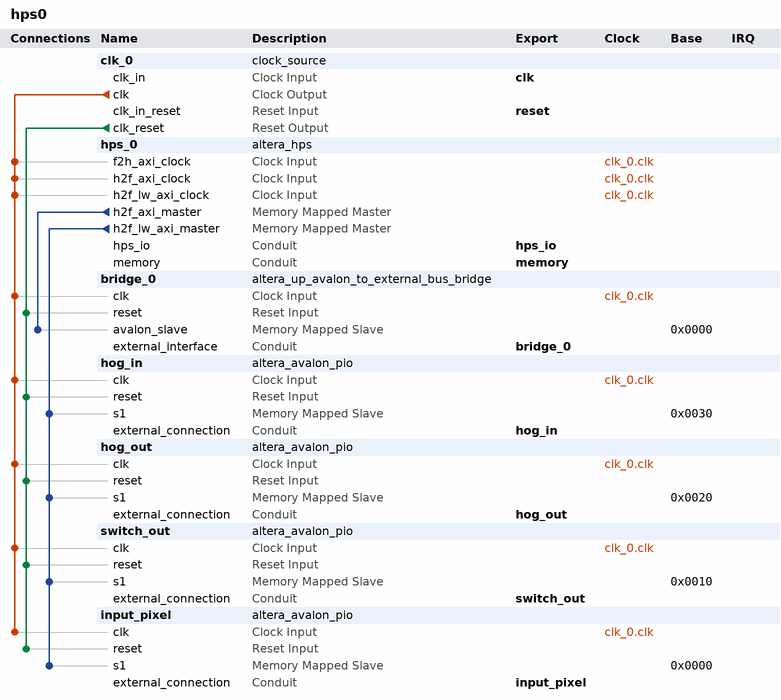
[diagram p0: system contents]
# Platform Designer (Qsys) system hps0, Cyclone V 5CSEMA5F31C6
# Parameters at their usual value, and those the tool derives, are not listed.
package require -exact qsys 22.1
create_system hps0
set_project_property DEVICE_FAMILY {Cyclone V}
set_project_property DEVICE 5CSEMA5F31C6

add_instance clk_0 clock_source 22.1
set_instance_parameter_value clk_0 clockFrequency 140000000

add_instance hps_0 altera_hps 22.1
set_instance_parameter_value hps_0 EMAC1_Mode RGMII
set_instance_parameter_value hps_0 EMAC1_PinMuxing {HPS I/O Set 0}
set_instance_parameter_value hps_0 F2SCLK_COLDRST_Enable false
set_instance_parameter_value hps_0 F2SCLK_DBGRST_Enable false
set_instance_parameter_value hps_0 F2SCLK_WARMRST_Enable false
set_instance_parameter_value hps_0 F2SINTERRUPT_Enable false
set_instance_parameter_value hps_0 F2S_Width 3
set_instance_parameter_value hps_0 FPGA_PERIPHERAL_OUTPUT_CLOCK_FREQ_EMAC0_GTX_CLK 125
set_instance_parameter_value hps_0 FPGA_PERIPHERAL_OUTPUT_CLOCK_FREQ_EMAC0_MD_CLK 2.5
set_instance_parameter_value hps_0 FPGA_PERIPHERAL_OUTPUT_CLOCK_FREQ_EMAC1_GTX_CLK 125
set_instance_parameter_value hps_0 FPGA_PERIPHERAL_OUTPUT_CLOCK_FREQ_EMAC1_MD_CLK 2.5
set_instance_parameter_value hps_0 HPS_PROTOCOL DDR3
set_instance_parameter_value hps_0 I2C0_Mode N/A
set_instance_parameter_value hps_0 I2C0_PinMuxing Unused
set_instance_parameter_value hps_0 I2C1_Mode N/A
set_instance_parameter_value hps_0 I2C1_PinMuxing Unused
set_instance_parameter_value hps_0 LWH2F_Enable true
set_instance_parameter_value hps_0 MEM_BANKADDR_WIDTH 3
set_instance_parameter_value hps_0 MEM_CLK_FREQ 400.0
set_instance_parameter_value hps_0 MEM_COL_ADDR_WIDTH 10
set_instance_parameter_value hps_0 MEM_DQ_WIDTH 32
set_instance_parameter_value hps_0 MEM_DRV_STR RZQ/7
set_instance_parameter_value hps_0 MEM_ROW_ADDR_WIDTH 15
set_instance_parameter_value hps_0 MEM_RTT_NOM RZQ/4
set_instance_parameter_value hps_0 MEM_RTT_WR {Dynamic ODT off}
set_instance_parameter_value hps_0 MEM_TCL 11
set_instance_parameter_value hps_0 MEM_TFAW_NS 30.0
set_instance_parameter_value hps_0 MEM_TRAS_NS 35.0
set_instance_parameter_value hps_0 MEM_TRCD_NS 13.75
set_instance_parameter_value hps_0 MEM_TRFC_NS 260.0
set_instance_parameter_value hps_0 MEM_TRP_NS 13.75
set_instance_parameter_value hps_0 MEM_VENDOR JEDEC
set_instance_parameter_value hps_0 MEM_WTCL 8
set_instance_parameter_value hps_0 QSPI_Mode N/A
set_instance_parameter_value hps_0 QSPI_PinMuxing Unused
set_instance_parameter_value hps_0 REF_CLK_FREQ 25.0
set_instance_parameter_value hps_0 S2FCLK_USER2CLK 5
set_instance_parameter_value hps_0 S2F_Width 3
set_instance_parameter_value hps_0 SDIO_Mode {4-bit Data}
set_instance_parameter_value hps_0 SDIO_PinMuxing {HPS I/O Set 0}
set_instance_parameter_value hps_0 SPIM1_Mode N/A
set_instance_parameter_value hps_0 SPIM1_PinMuxing Unused
set_instance_parameter_value hps_0 STM_Enable false
set_instance_parameter_value hps_0 TIMING_BOARD_AC_SKEW 0.03
set_instance_parameter_value hps_0 TIMING_BOARD_AC_TO_CK_SKEW 0.0
set_instance_parameter_value hps_0 TIMING_BOARD_DQ_TO_DQS_SKEW 0.0
set_instance_parameter_value hps_0 TIMING_BOARD_MAX_CK_DELAY 0.03
set_instance_parameter_value hps_0 TIMING_BOARD_MAX_DQS_DELAY 0.02
set_instance_parameter_value hps_0 TIMING_BOARD_SKEW_BETWEEN_DQS 0.08
set_instance_parameter_value hps_0 TIMING_BOARD_SKEW_CKDQS_DIMM_MAX 0.16
set_instance_parameter_value hps_0 TIMING_BOARD_SKEW_CKDQS_DIMM_MIN 0.09
set_instance_parameter_value hps_0 TIMING_BOARD_SKEW_WITHIN_DQS 0.01
set_instance_parameter_value hps_0 TIMING_TDH 65
set_instance_parameter_value hps_0 TIMING_TDQSCK 255
set_instance_parameter_value hps_0 TIMING_TDQSQ 125
set_instance_parameter_value hps_0 TIMING_TDS 30
set_instance_parameter_value hps_0 TIMING_TIH 140
set_instance_parameter_value hps_0 TIMING_TIS 180
set_instance_parameter_value hps_0 TIMING_TQSH 0.4
set_instance_parameter_value hps_0 UART0_Mode {No Flow Control}
set_instance_parameter_value hps_0 UART0_PinMuxing {HPS I/O Set 0}
set_instance_parameter_value hps_0 USB1_Mode SDR
set_instance_parameter_value hps_0 USB1_PinMuxing {HPS I/O Set 0}
set_instance_parameter_value hps_0 desired_cfg_clk_mhz 100.0
set_instance_parameter_value hps_0 desired_qspi_clk_mhz 400.0

add_instance bridge_0 altera_up_avalon_to_external_bus_bridge 18.0
set_instance_parameter_value bridge_0 addr_size 32
set_instance_parameter_value bridge_0 addr_size_multiplier bytes
set_instance_parameter_value bridge_0 data_size 128

add_instance hog_in altera_avalon_pio 22.1
set_instance_parameter_value hog_in captureEdge true
set_instance_parameter_value hog_in direction Input
set_instance_parameter_value hog_in width 32

add_instance hog_out altera_avalon_pio 22.1
set_instance_parameter_value hog_out captureEdge true
set_instance_parameter_value hog_out direction Input
set_instance_parameter_value hog_out width 32

add_instance switch_out altera_avalon_pio 22.1
set_instance_parameter_value switch_out captureEdge true
set_instance_parameter_value switch_out direction Input
set_instance_parameter_value switch_out width 32

add_instance input_pixel altera_avalon_pio 22.1
set_instance_parameter_value input_pixel captureEdge true
set_instance_parameter_value input_pixel direction Input
set_instance_parameter_value input_pixel width 32

# connections
add_connection clk_0.clk bridge_0.clk clock
add_connection clk_0.clk hog_in.clk clock
add_connection clk_0.clk hog_out.clk clock
add_connection clk_0.clk hps_0.f2h_axi_clock clock
add_connection clk_0.clk hps_0.h2f_axi_clock clock
add_connection clk_0.clk hps_0.h2f_lw_axi_clock clock
add_connection clk_0.clk input_pixel.clk clock
add_connection clk_0.clk switch_out.clk clock
add_connection clk_0.clk_reset bridge_0.reset reset
add_connection clk_0.clk_reset hog_in.reset reset
add_connection clk_0.clk_reset hog_out.reset reset
add_connection clk_0.clk_reset input_pixel.reset reset
add_connection clk_0.clk_reset switch_out.reset reset
add_connection hps_0.h2f_axi_master bridge_0.avalon_slave avalon
set_connection_parameter_value hps_0.h2f_axi_master/bridge_0.avalon_slave baseAddress 0x0000
add_connection hps_0.h2f_lw_axi_master hog_in.s1 avalon
set_connection_parameter_value hps_0.h2f_lw_axi_master/hog_in.s1 baseAddress 0x0030
add_connection hps_0.h2f_lw_axi_master hog_out.s1 avalon
set_connection_parameter_value hps_0.h2f_lw_axi_master/hog_out.s1 baseAddress 0x0020
add_connection hps_0.h2f_lw_axi_master input_pixel.s1 avalon
set_connection_parameter_value hps_0.h2f_lw_axi_master/input_pixel.s1 baseAddress 0x0000
add_connection hps_0.h2f_lw_axi_master switch_out.s1 avalon
set_connection_parameter_value hps_0.h2f_lw_axi_master/switch_out.s1 baseAddress 0x0010

# exported interfaces
add_interface bridge_0 conduit end
set_interface_property bridge_0 EXPORT_OF bridge_0.external_interface
add_interface clk clock sink
set_interface_property clk EXPORT_OF clk_0.clk_in
add_interface hog_in conduit end
set_interface_property hog_in EXPORT_OF hog_in.external_connection
add_interface hog_out conduit end
set_interface_property hog_out EXPORT_OF hog_out.external_connection
add_interface hps_io conduit end
set_interface_property hps_io EXPORT_OF hps_0.hps_io
add_interface input_pixel conduit end
set_interface_property input_pixel EXPORT_OF input_pixel.external_connection
add_interface memory conduit end
set_interface_property memory EXPORT_OF hps_0.memory
add_interface reset reset sink
set_interface_property reset EXPORT_OF clk_0.clk_in_reset
add_interface switch_out conduit end
set_interface_property switch_out EXPORT_OF switch_out.external_connection

set_interconnect_requirement {$system} qsys_mm.clockCrossingAdapter HANDSHAKE
set_interconnect_requirement {$system} qsys_mm.enableEccProtection FALSE
set_interconnect_requirement {$system} qsys_mm.insertDefaultSlave FALSE
set_interconnect_requirement {$system} qsys_mm.maxAdditionalLatency 1

save_system hps0.qsys
